# EAGLE design dc10_revA (EAGLE 7.2.0)
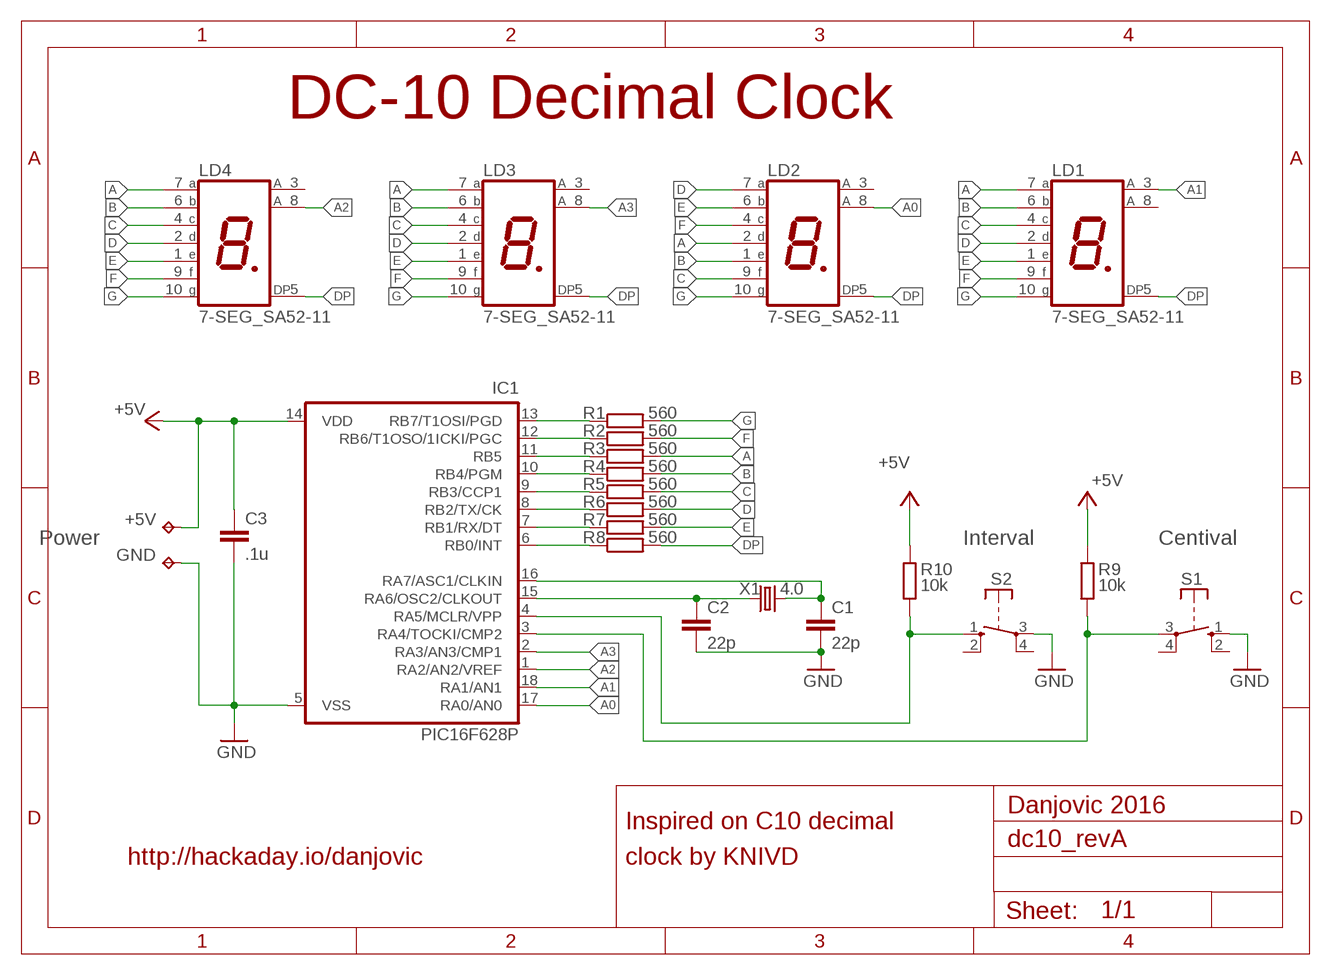
[diagram p0: schematic, sheet 1]

## Parts
+5V  TPPAD1-13  [P1-13]
C1  22p  C-EU050-024X044  [C050-024X044]
C2  22p  C-EU050-024X044  [C050-024X044]
C3  .1u  C-EU050-024X044  [C050-024X044]
GND  TPPAD1-13  [P1-13]
IC1  PIC16F628P  [DIL18]
LD1  7-SEG_SA52-11  [SA52-11]
LD2  7-SEG_SA52-11  [SA52-11]
LD3  7-SEG_SA52-11  [SA52-11]
LD4  7-SEG_SA52-11  [SA52-11]
R1  560  R-EU_0204/7  [0204/7]
R2  560  R-EU_0204/7  [0204/7]
R3  560  R-EU_0204/7  [0204/7]
R4  560  R-EU_0204/7  [0204/7]
R5  560  R-EU_0204/7  [0204/7]
R6  560  R-EU_0204/7  [0204/7]
R7  560  R-EU_0204/7  [0204/7]
R8  560  R-EU_0204/7  [0204/7]
R9  10k  R-EU_0204/7  [0204/7]
R10  10k  R-EU_0204/7  [0204/7]
S1  RACON12  [RACON12]
S2  RACON12  [RACON12]
X1  4.0  CRYSTALHC49U-V  [HC49U-V]

## Nets
+5V: +5V.1(TP) C3.1 IC1.14(VDD) R9.1 R10.1
A: LD1.7(A) LD2.2(D) LD3.7(A) LD4.7(A) R3.2
A0: IC1.17(RA0/AN0) LD2.8(A)
A1: IC1.18(RA1/AN1) LD1.3(A)
A2: IC1.1(RA2/AN2/VREF) LD4.8(A)
A3: IC1.2(RA3/AN3/CMP1) LD3.8(A)
A4: IC1.3(RA4/TOCKI/CMP2) R9.2 S1.3(P)
A5: IC1.4(RA5/MCLR/VPP) R10.2 S2.1(S)
B: LD1.6(B) LD2.1(E) LD3.6(B) LD4.6(B) R4.2
B0: IC1.6(RB0/INT) R8.1
B1: IC1.7(RB1/RX/DT) R7.1
B2: IC1.8(RB2/TX/CK) R6.1
B3: IC1.9(RB3/CCP1) R5.1
B4: IC1.10(RB4/PGM) R4.1
B5: IC1.11(RB5) R3.1
B6: IC1.12(RB6/T1OSO/1ICKI/PGC) R2.1
B7: IC1.13(RB7/T1OSI/PGD) R1.1
C: LD1.4(C) LD2.9(F) LD3.4(C) LD4.4(C) R5.2
D: LD1.2(D) LD2.7(A) LD3.2(D) LD4.2(D) R6.2
DP: LD1.5(DP) LD2.5(DP) LD3.5(DP) LD4.5(DP) R8.2
E: LD1.1(E) LD2.6(B) LD3.1(E) LD4.1(E) R7.2
F: LD1.9(F) LD2.4(C) LD3.9(F) LD4.9(F) R2.2
G: LD1.10(G) LD2.10(G) LD3.10(G) LD4.10(G) R1.2
GND: C1.2 C2.2 C3.2 GND.1(TP) IC1.5(VSS) S1.1(S) S2.3(P)
OSC1: C1.1 IC1.16(RA7/ASC1/CLKIN) X1.2
OSC2: C2.1 IC1.15(RA6/OSC2/CLKOUT) X1.1
Unconnected: LD1.8(A) LD2.3(A) LD3.3(A) LD4.3(A) S1.2(S) S1.4(P) S2.2(S) S2.4(P)

## Notes on the sheet
- DC-10 Decimal Clock
- Power | Interval | Centival
- Danjovic 2016
- Inspired on C10 decimal
- http://hackaday.io/danjovic | clock by KNIVD

## Library data of the parts
+5V GND = testpad:TP: Test pad
C1-C3 = rcl:C-EU: CAPACITOR, European symbol
IC1 = microchip:PIC16*F62: FLASH-Based 8-Bit CMOS Microcontroller Source: http://ww1.microchip.com/downloads/en/DeviceDoc/40300C.pdf
LD1-LD4 = display-kingbright:7-SEG_: Kingbright 14.2mm (0.56 INCH) SINGLE DIGIT NUMERIC DUISPLAY Source: SA56-11EWA(Ver1189471036.pdf
R1-R10 = rcl:R-EU_: RESISTOR, European symbol
S1 S2 = switch-misc:RACON12: ITT SWITCH
X1 = crystal:CRYSTAL: CRYSTAL

## Board
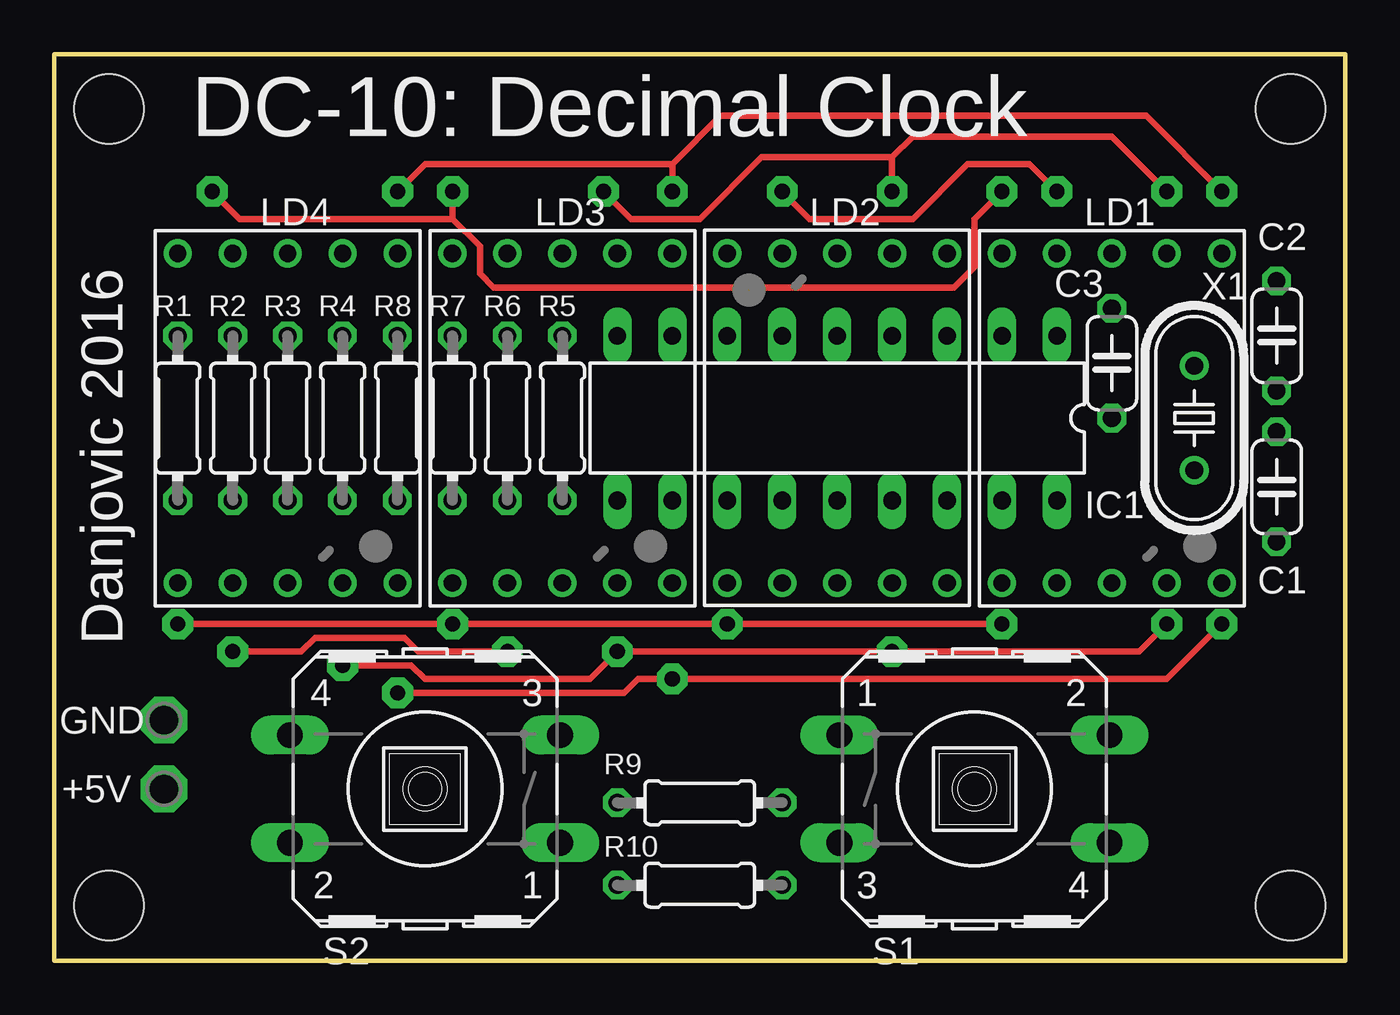
[diagram p1: board, top side]
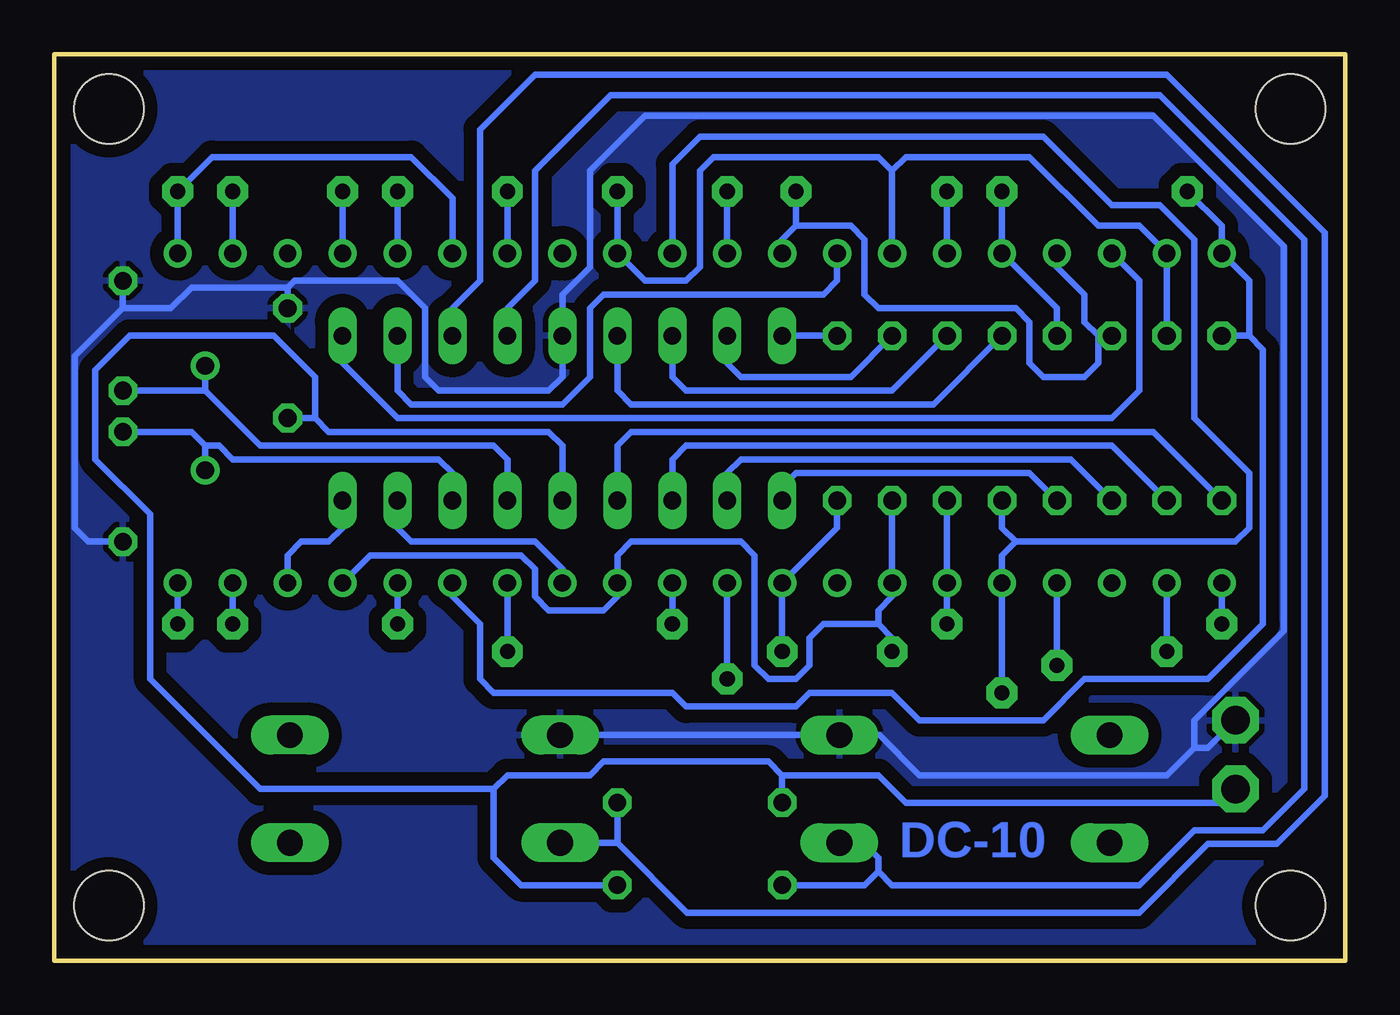
[diagram p2: board, bottom side, seen from below]

Size 59.69 x 41.91 mm. Coordinates in mm from the lower left corner, seen from the top.
Outline: 0,0 0,41.91 59.69,41.91 59.69,0 0,0
Copper layers (1*16): Top 0.035mm / dielectric 1.5mm / Bottom 0.035mm
Design rules "default *": minimum track width 10mil, minimum drill 24mil, track to track 8mil, track to pad 8mil, pad to pad 8mil, via to via 8mil, smd to smd 8mil, copper to edge 25mil, drill to drill 8mil, minimum pad ring 10mil, minimum via ring 8mil, stop-mask expansion 4mil, vias tented up to drill 0mil, thermal gap 10mil
Holes 3.2 mm at 2.54,39.37 57.15,39.37 57.15,2.54 2.54,2.54

### Footprints (pad centres in the part's own frame; a part is rotated, then mirrored left to right if it is on the bottom)
P1-13 = drill 1.321 pad 2.159 octagon: 1 0,0
C050-024X044 = drill 0.813 octagon: 1 -2.54,0; 2 2.54,0
DIL18 = drill 0.813 long: 1 -10.16,-3.81; 2 -7.62,-3.81; 3 -5.08,-3.81; 4 -2.54,-3.81; 5 0,-3.81; 6 2.54,-3.81; 7 5.08,-3.81; 8 7.62,-3.81; 9 10.16,-3.81; 10 10.16,3.81; 11 7.62,3.81; 12 5.08,3.81; 13 2.54,3.81; 14 0,3.81; 15 -2.54,3.81; 16 -5.08,3.81; 17 -7.62,3.81; 18 -10.16,3.81
SA52-11 = drill 0.8: 1 -5.08,-7.62; 2 -2.54,-7.62; 3 0,-7.62; 4 2.54,-7.62; 5 5.08,-7.62; 6 5.08,7.62; 7 2.54,7.62; 8 0,7.62; 9 -2.54,7.62; 10 -5.08,7.62
0204/7 = drill 0.813 octagon: 1 -3.81,0; 2 3.81,0
RACON12 = drill 1.194 long: 1 -6.248,2.489; 2 6.248,2.489; 3 -6.248,-2.489; 4 6.248,-2.489
HC49U-V = drill 0.813: 1 -2.413,0; 2 2.413,0

### Placement (x,y rotation side)
+5V  5.08,7.94 0 top
C1  56.52,21.91 270 top
C2  56.52,28.89 90 top
C3  48.89,27.62 90 top
GND  5.08,11.11 0 top
IC1  36.19,25.08 180 top
LD1  48.89,25.08 0 top
LD2  36.19,25.08 180 top
LD3  23.5,25.08 0 top
LD4  10.79,25.08 0 top
R1  5.71,25.08 90 top
R2  8.25,25.08 90 top
R3  10.79,25.08 90 top
R4  13.34,25.08 90 top
R5  23.5,25.08 270 top
R6  20.96,25.08 270 top
R7  18.42,25.08 270 top
R8  15.88,25.08 270 top
R9  29.85,7.3 0 top
R10  29.85,3.49 180 top
S1  42.55,7.94 0 top
S2  17.14,7.94 180 top
X1  52.7,25.08 270 top

### Tracks (layer width: path | path; a pad name or v marks a point on that pad's centre or on a via)
+5V
  Bottom 0.305: IC1.14 36.19,23.81 36.83,24.45 46.99,24.45 47.62,25.08 | 47.62,25.08 C3.1 | 47.62,25.08 47.62,26.99 49.53,28.89 56.2,28.89 57.78,27.3 57.78,23.18 55.24,20.64 55.24,13.02 50.16,7.94 39.37,7.94 | 26.04,8.57 21.59,8.57 20.32,7.3 5.71,7.3 +5V.1 | 26.04,8.57 26.67,9.21 34.29,9.21 34.92,8.57 38.73,8.57 39.37,7.94 | 26.04,8.57 R9.1 | R10.1 38.1,3.49 39.37,4.76 39.37,7.94
A  (via drill 0.7 pad 1.42)
  Top 0.305: 38.73,37.15 v38.73,35.56 | v25.4,35.56 26.67,34.29 29.85,34.29 32.7,37.15 38.73,37.15 | v51.44,35.56 48.89,38.1 39.69,38.1 38.73,37.15
  Bottom 0.305: v51.44,35.56 LD1.7 | v38.73,35.56 LD2.2 | LD3.7 26.04,33.34 25.4,33.97 | 25.4,33.97 22.86,33.97 22.22,33.34 22.22,30.8 21.59,30.16 15.24,30.16 14.61,29.53 14.61,27.62 13.97,26.99 12.07,26.99 11.43,27.62 11.43,28.89 | 11.43,28.89 R3.2 | LD4.7 13.34,32.07 12.07,30.8 12.07,29.53 11.43,28.89 | 25.4,33.97 v25.4,35.56
A0
  Bottom 0.305: IC1.17 43.81,20 43.18,19.37 37.47,19.37 36.19,18.1 LD2.8
A1
  Bottom 0.305: IC1.18 46.36,20 46.99,19.37 48.26,19.37 48.89,18.73 LD1.3
A2
  Bottom 0.305: IC1.1 46.36,27.62 43.81,25.08 10.79,25.08 9.52,26.35 9.52,31.43 LD4.8
A3
  Bottom 0.305: LD3.8 23.5,31.43 24.13,30.8 34.29,30.8 34.92,30.16 34.92,26.99 36.19,25.72 43.18,25.72 43.81,26.35 IC1.2
A4
  Bottom 0.305: IC1.3 41.28,30.16 40,31.43 40,38.42 37.47,40.96 8.25,40.96 0.95,33.66 0.95,7.62 3.18,5.4 6.35,5.4 9.52,2.22 30.43,2.22 33.66,5.45 | 33.66,5.45 R9.2 | 33.66,5.45 S1.3
A5
  Bottom 0.305: IC1.4 38.73,30.16 37.47,31.43 37.47,36.51 33.97,40 8.57,40 1.91,33.34 1.91,7.94 3.81,6.03 6.98,6.03 9.52,3.49 20.96,3.49 21.59,4.13 | 21.59,4.13 22.22,3.49 R10.2 | S2.1 22.28,5.45 21.59,4.76 21.59,4.13
B  (via drill 0.7 pad 1.42)
  Top 0.305: v15.88,35.56 17.14,36.83 28.57,36.83 | v53.97,35.56 50.48,39.05 30.8,39.05 28.57,36.83 | 28.57,36.83 v28.57,35.56
  Bottom 0.305: R4.2 13.34,30.16 LD4.6 v15.88,35.56 | v28.57,35.56 LD3.6 | LD1.6 v53.97,35.56 52.39,37.15 43.18,37.15 41.28,35.24 LD2.1
B0
  Bottom 0.305: IC1.6 33.66,26.35 33.02,25.72 19.05,25.72 R8.1
B1
  Bottom 0.305: IC1.7 31.11,26.99 30.48,26.35 20.96,26.35 R7.1
B2
  Bottom 0.305: IC1.8 28.57,27.62 27.94,26.99 22.86,26.99 R6.1
B3
  Bottom 0.305: R5.1 IC1.9
B4
  Bottom 0.305: IC1.10 26.04,21.91 25.4,22.54 14.61,22.54 R4.1
B5
  Bottom 0.305: IC1.11 28.57,22.54 27.94,23.18 12.7,23.18 R3.1
B6
  Bottom 0.305: IC1.12 31.11,23.18 30.48,23.81 10.79,23.81 R2.1
B7
  Bottom 0.305: IC1.13 33.66,23.81 33.02,24.45 8.89,24.45 R1.1
C  (via drill 0.7 pad 1.42)
  Top 0.305: v13.34,13.65 16.51,13.65 17.14,13.02 24.76,13.02 v26.04,14.29 v38.73,14.29 50.16,14.29 v51.44,15.56
  Bottom 0.305: R5.2 23.5,20 LD3.4 v26.04,14.29 | v13.34,13.65 LD4.4 | v38.73,14.29 LD2.9 | v51.44,15.56 LD1.4
D  (via drill 0.7 pad 1.42)
  Top 0.305: v8.25,14.29 11.43,14.29 12.07,14.92 16.19,14.92 16.83,14.29 v20.96,14.29
  Bottom 0.305: R6.2 LD3.2 20.96,16.83 21.59,16.19 21.59,15.56 | v8.25,14.29 LD4.2 | v20.96,14.29 20.96,14.92 21.59,15.56 | LD1.2 45.08,18.73 38.1,18.73 37.47,18.1 37.47,16.83 36.83,16.19 34.29,16.19 33.66,16.83 LD2.7 33.66,18.73 33.02,19.37 27.94,19.37 27.3,18.73 27.3,13.65 26.67,13.02 25.4,13.02 24.76,13.65 24.76,14.92 24.13,15.56 21.59,15.56
DP  (via drill 0.7 pad 1.42)
  Top 0.305: v15.88,12.38 26.35,12.38 26.99,13.02 v28.57,13.02 51.44,13.02 v53.97,15.56
  Bottom 0.305: v15.88,12.38 LD4.5 15.88,18.73 15.24,19.37 | v28.57,13.02 LD3.5 | v53.97,15.56 LD1.5 | LD2.5 31.11,36.83 29.85,38.1 13.97,38.1 10.79,34.92 8.57,34.92 6.98,33.34 6.98,25.08 4.45,22.54 4.45,20 5.08,19.37 15.24,19.37 | R8.2 15.88,20 15.24,19.37
E  (via drill 0.7 pad 1.42)
  Top 0.305: v5.71,15.56 v18.42,15.56 v31.11,15.56 v43.81,15.56
  Bottom 0.305: R7.2 LD3.1 v18.42,15.56 | v5.71,15.56 LD4.1 | v31.11,15.56 LD2.6 | v43.81,15.56 LD1.1
F  (via drill 0.7 pad 1.42)
  Top 0.305: v46.36,35.56 45.08,36.83 42.23,36.83 39.69,34.29 34.92,34.29 v33.66,35.56
  Bottom 0.305: R2.2 LD4.9 9.52,33.97 11.43,33.97 14.61,37.15 20.32,37.15 20.96,36.51 | v33.66,35.56 LD2.4 32.39,31.43 30.48,31.43 29.85,32.07 29.85,36.51 29.21,37.15 21.59,37.15 20.96,36.51 | v46.36,35.56 LD1.9 | 20.96,36.51 LD3.9
G  (via drill 0.7 pad 1.42)
  Top 0.305: 18.42,34.29 8.57,34.29 v7.3,35.56 | v43.81,35.56 42.55,34.29 42.55,32.07 41.59,31.11 20.32,31.11 19.68,31.75 19.68,33.02 18.42,34.29 | 18.42,34.29 v18.42,35.56
  Bottom 0.305: v43.81,35.56 LD1.10 | v18.42,35.56 LD3.10 | LD2.10 41.28,16.83 40,15.56 40,13.02 39.37,12.38 31.11,12.38 30.48,11.75 25.4,11.75 24.76,12.38 20.96,12.38 19.68,11.11 13.97,11.11 12.07,13.02 6.35,13.02 3.81,15.56 3.81,28.26 4.45,28.89 | 4.45,28.89 R1.2 | 4.45,28.89 4.45,31.43 LD4.10 5.71,33.97 v7.3,35.56
GND
  Bottom 0.305: 48.89,31.11 48.58,31.43 43.81,31.43 42.55,30.16 42.55,26.99 41.91,26.35 36.83,26.35 36.19,26.99 IC1.5 36.19,30.8 34.92,32.07 34.92,36.51 32.39,39.05 8.89,39.05 2.86,33.02 2.86,15.24 6.98,11.11 6.98,9.84 | 48.89,31.11 C3.2 | 48.89,31.11 53.34,31.11 54.29,30.16 56.52,30.16 | 56.52,30.16 58.74,27.94 58.74,20 58.1,19.37 C1.2 | 56.52,30.16 C2.2 | 6.98,9.84 8.25,8.57 19.68,8.57 21.54,10.43 S2.3 S1.1 | GND.1 6.35,9.84 6.98,9.84
  pour Bottom (isolate 0.61): 0,0 59.69,0 59.69,41.91 0,41.91
OSC1
  Bottom 0.305: IC1.16 41.28,22.54 41.91,23.18 51.44,23.18 52.07,23.81 52.7,23.81 | 52.7,23.81 53.34,24.45 C1.1 | 52.7,23.81 X1.2
OSC2
  Bottom 0.305: IC1.15 38.73,23.18 39.37,23.81 50.16,23.81 52.7,26.35 | 52.7,26.35 C2.1 | 52.7,26.35 X1.1

### Text on the board
Bottom: DC-10
tNames: DC-10: Decimal Clock | Danjovic 2016